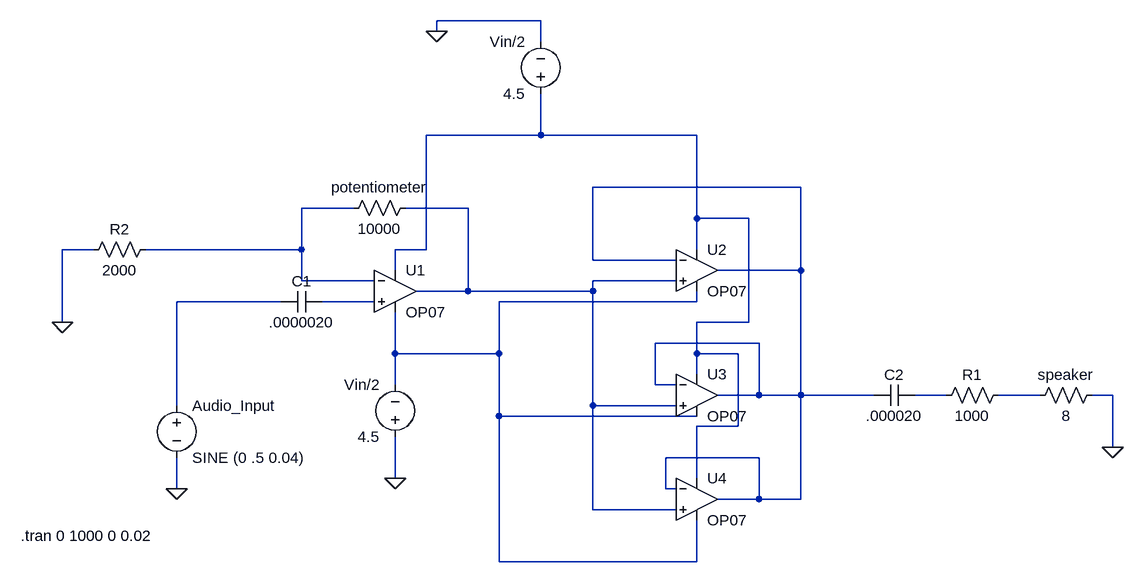
[diagram p0: schematic reciever design.asc]
reciever design.asc, the LTspice schematic file:
Version 4
SHEET 1 1556 680
WIRE 656 -240 496 -240
WIRE 496 -224 496 -240
WIRE 656 -208 656 -240
WIRE 656 -64 656 -128
WIRE 656 -64 480 -64
WIRE 896 -64 656 -64
WIRE 1056 16 736 16
WIRE 368 48 288 48
WIRE 544 48 448 48
WIRE 896 64 896 -64
WIRE 976 64 896 64
WIRE -32 112 -80 112
WIRE 288 112 288 48
WIRE 288 112 48 112
WIRE 480 112 480 -64
WIRE 480 112 432 112
WIRE 896 112 896 64
WIRE 736 128 736 16
WIRE 864 128 736 128
WIRE 432 144 432 112
WIRE 1056 144 1056 16
WIRE 1056 144 928 144
WIRE 288 160 288 112
WIRE 400 160 288 160
WIRE 864 160 736 160
WIRE 544 176 544 48
WIRE 544 176 464 176
WIRE 736 176 736 160
WIRE 736 176 544 176
WIRE 256 192 96 192
WIRE 400 192 320 192
WIRE 896 192 896 176
WIRE 896 192 592 192
WIRE -80 224 -80 112
WIRE 976 224 976 64
WIRE 976 224 896 224
WIRE 992 256 832 256
WIRE 432 272 432 208
WIRE 592 272 592 192
WIRE 592 272 432 272
WIRE 896 272 896 224
WIRE 960 272 896 272
WIRE 896 304 896 272
WIRE 432 320 432 272
WIRE 832 320 832 256
WIRE 864 320 832 320
WIRE 992 336 992 256
WIRE 992 336 928 336
WIRE 1056 336 1056 144
WIRE 1056 336 992 336
WIRE 1168 336 1056 336
WIRE 1280 336 1232 336
WIRE 1424 336 1360 336
WIRE 1536 336 1504 336
WIRE 96 352 96 192
WIRE 736 352 736 176
WIRE 864 352 736 352
WIRE 592 368 592 272
WIRE 896 368 592 368
WIRE 960 384 960 272
WIRE 960 384 896 384
WIRE 1536 416 1536 336
WIRE 992 432 848 432
WIRE 432 464 432 400
WIRE 896 464 896 384
WIRE 96 480 96 432
WIRE 848 480 848 432
WIRE 864 480 848 480
WIRE 992 496 992 432
WIRE 992 496 928 496
WIRE 1056 496 1056 336
WIRE 1056 496 992 496
WIRE 736 512 736 352
WIRE 864 512 736 512
WIRE 592 592 592 368
WIRE 896 592 896 528
WIRE 896 592 592 592
FLAG 96 480 0
FLAG -80 224 0
FLAG 496 -224 0
FLAG 432 464 0
FLAG 1536 416 0
SYMBOL Opamps\\OP07 432 112 R0
SYMATTR InstName U1
SYMBOL res 464 32 R90
WINDOW 0 0 56 VBottom 2
WINDOW 3 32 56 VTop 2
SYMATTR InstName potentiometer
SYMATTR Value 10000
SYMBOL voltage 96 336 R0
SYMATTR InstName Audio_Input
SYMATTR Value SINE (0 .5 0.04)
SYMBOL res 64 96 R90
WINDOW 0 0 56 VBottom 2
WINDOW 3 32 56 VTop 2
SYMATTR InstName R2
SYMATTR Value 2000
SYMBOL Opamps\\OP07 896 80 R0
SYMATTR InstName U2
SYMBOL voltage 656 -112 R180
WINDOW 0 24 96 Left 2
WINDOW 3 24 16 Left 2
WINDOW 123 0 0 Left 0
WINDOW 39 0 0 Left 0
SYMATTR InstName Vin/2
SYMATTR Value 4.5
SYMBOL voltage 432 416 R180
WINDOW 0 24 96 Left 2
WINDOW 3 24 16 Left 2
WINDOW 123 0 0 Left 0
WINDOW 39 0 0 Left 0
SYMATTR InstName Vin/2
SYMATTR Value 4.5
SYMBOL cap 320 176 R90
WINDOW 0 0 32 VBottom 2
WINDOW 3 32 32 VTop 2
SYMATTR InstName C1
SYMATTR Value .0000020
SYMBOL Opamps\\OP07 896 272 R0
SYMATTR InstName U3
SYMBOL Opamps\\OP07 896 432 R0
SYMATTR InstName U4
SYMBOL cap 1232 320 R90
WINDOW 0 0 32 VBottom 2
WINDOW 3 32 32 VTop 2
SYMATTR InstName C2
SYMATTR Value .000020
SYMBOL res 1376 320 R90
WINDOW 0 0 56 VBottom 2
WINDOW 3 32 56 VTop 2
SYMATTR InstName R1
SYMATTR Value 1000
SYMBOL res 1520 320 R90
WINDOW 0 0 56 VBottom 2
WINDOW 3 32 56 VTop 2
SYMATTR InstName speaker
SYMATTR Value 8
TEXT -144 552 Left 2 !.tran 0 1000 0 0.02

The netlist it stands for:
* reciever design.asc
XU1 N006 N003 N001 N007 N004 LT1001  ; OP07, pins In+ In- V+ V- OUT
R§potentiometer N004 N003 10000
V§Audio_Input N005 0 SINE (0 .5 0.04)
R2 N003 0 2000
XU2 N004 N002 N001 N007 N002 LT1001  ; OP07, pins In+ In- V+ V- OUT
Vin/2 N001 0 4.5
Vin/2 0 N007 4.5
C1 N006 N005 .0000020
XU3 N004 N002 N001 N007 N002 LT1001  ; OP07, pins In+ In- V+ V- OUT
XU4 N004 N002 N001 N007 N002 LT1001  ; OP07, pins In+ In- V+ V- OUT
C2 N008 N002 .000020
R1 N009 N008 1000
R§speaker 0 N009 8
.tran 0 1000 0 0.02
.lib LTC.lib
.backanno
.end